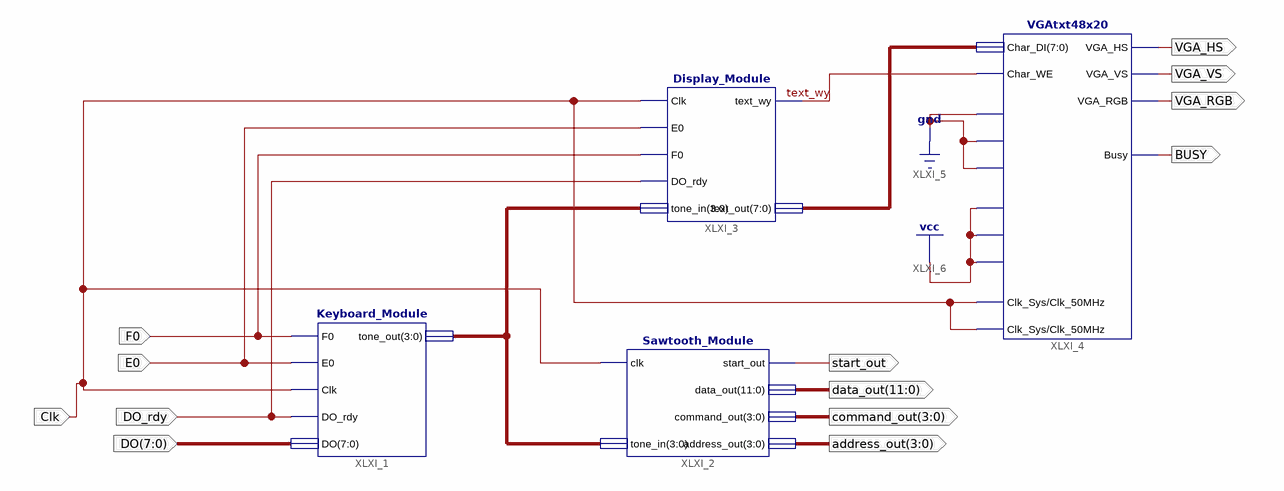
[diagram p0: schematic sheet 1]
// Xilinx ISE schematic Sub_Schema.sch (spartan3e) as structural Verilog: 4 symbols, 13 ports
module Sub_Schema (
  input  Clk,
  input  F0,
  input  DO_rdy,
  input  [7:0] DO,
  input  E0,
  output start_out,
  output [11:0] data_out,
  output [3:0] command_out,
  output [3:0] address_out,
  output VGA_HS,
  output VGA_VS,
  output VGA_RGB,
  output BUSY
);

  wire text_wy;
  wire [3:0] XLXN_8;
  wire [7:0] XLXN_23;

  Keyboard_Module XLXI_1 (.F0(F0), .E0(E0), .Clk(Clk), .DO_rdy(DO_rdy), .DO(DO), .tone_out(XLXN_8));
  Sawtooth_Module XLXI_2 (
    .clk(Clk), .tone_in(XLXN_8), .start_out(start_out), .data_out(data_out), .command_out(command_out),
    .address_out(address_out));
  Display_Module XLXI_3 (
    .Clk(Clk), .E0(E0), .F0(F0), .DO_rdy(DO_rdy), .tone_in(XLXN_8), .text_wy(text_wy), .text_out(XLXN_23));
  VGAtxt48x20 XLXI_4 (
    .Char_DI(XLXN_23), .Home(1'b0), .NewLine(1'b0), .Goto00(1'b0), .Clk_Sys(Clk), .Clk_50MHz(Clk),
    .CursorOn(1'b1), .ScrollEn(1'b1), .ScrollClear(1'b1), .Busy(BUSY), .VGA_HS(VGA_HS), .VGA_VS(VGA_VS),
    .VGA_RGB(VGA_RGB), .Char_WE(text_wy));
endmodule
